# EAGLE schematic Nokia1600 (EAGLE 7.7.0)
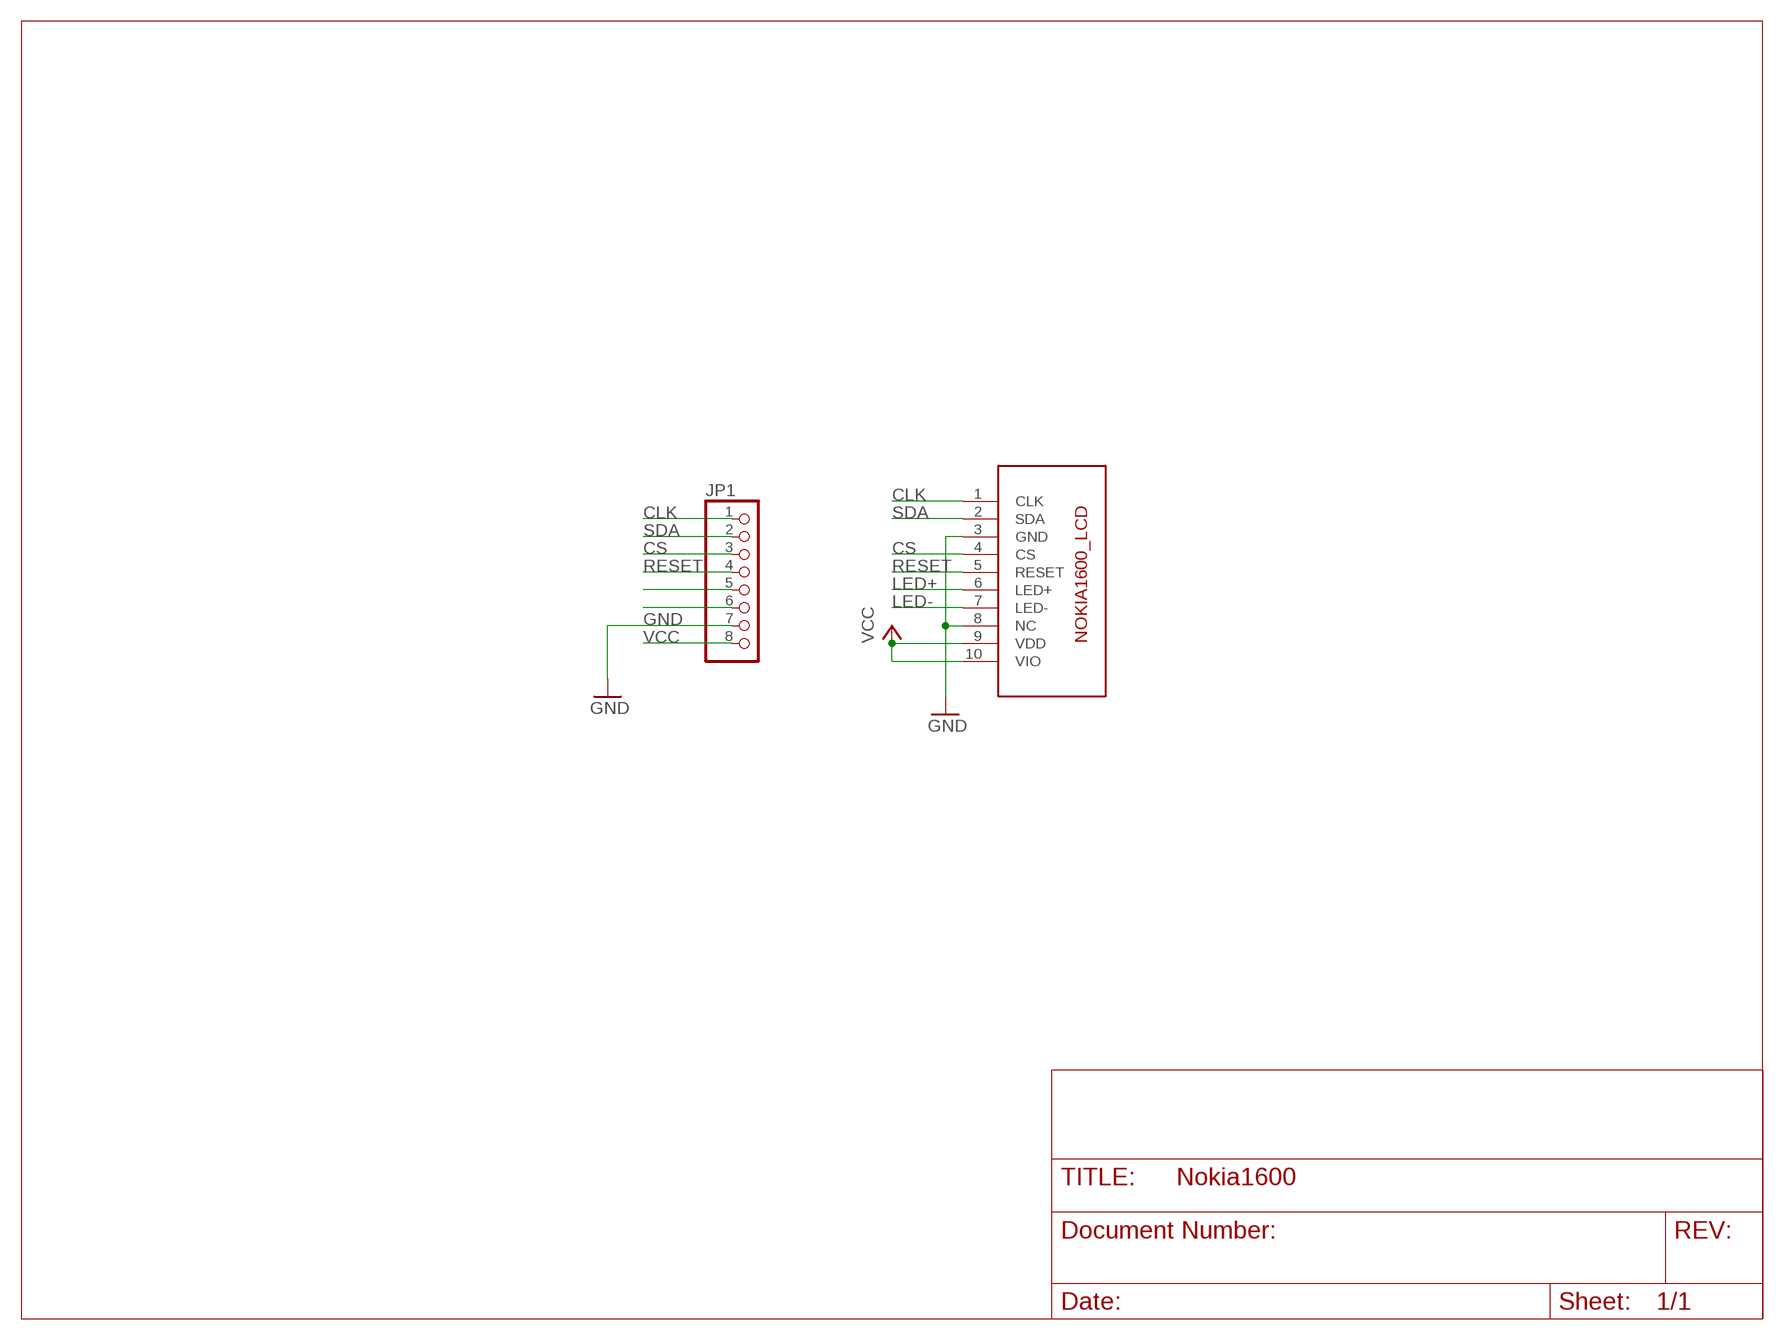
[diagram p0: schematic, sheet 1]

## Parts
JP1  HEADER-1X8ROUND  [1X08_ROUND]
U$1  NOKIA1600_LCD  [NOKIA1600_LCD]

## Nets
CLK: JP1.1 U$1.1(CLK)
CS: JP1.3 U$1.4(CS)
GND [power]: JP1.7 U$1.3(GND) U$1.8(NC)
LED+ [power]: JP1.5 U$1.6(LED+)
LED-: JP1.6 U$1.7(LED-)
RESET: JP1.4 U$1.5(RESET)
SDA: JP1.2 U$1.2(SDA)
VCC [power]: JP1.8 U$1.9(VDD) U$1.10(VIO)

## Library data of the parts
JP1 = microbuilder:HEADER-1X8: PIN HEADER
U$1 = PeterAtMega644:NOKIA1600_LCD

## Net classes
0 default: width 0.203 mm, drill 0.305 mm, clearance 0.152 mm
1 power: width 0.203 mm, drill 0.305 mm, clearance 0.152 mm